# Altium schematic sheet ADC_Interface.SchDoc
size A4; SheetNumber: 6; SheetTotal: 16
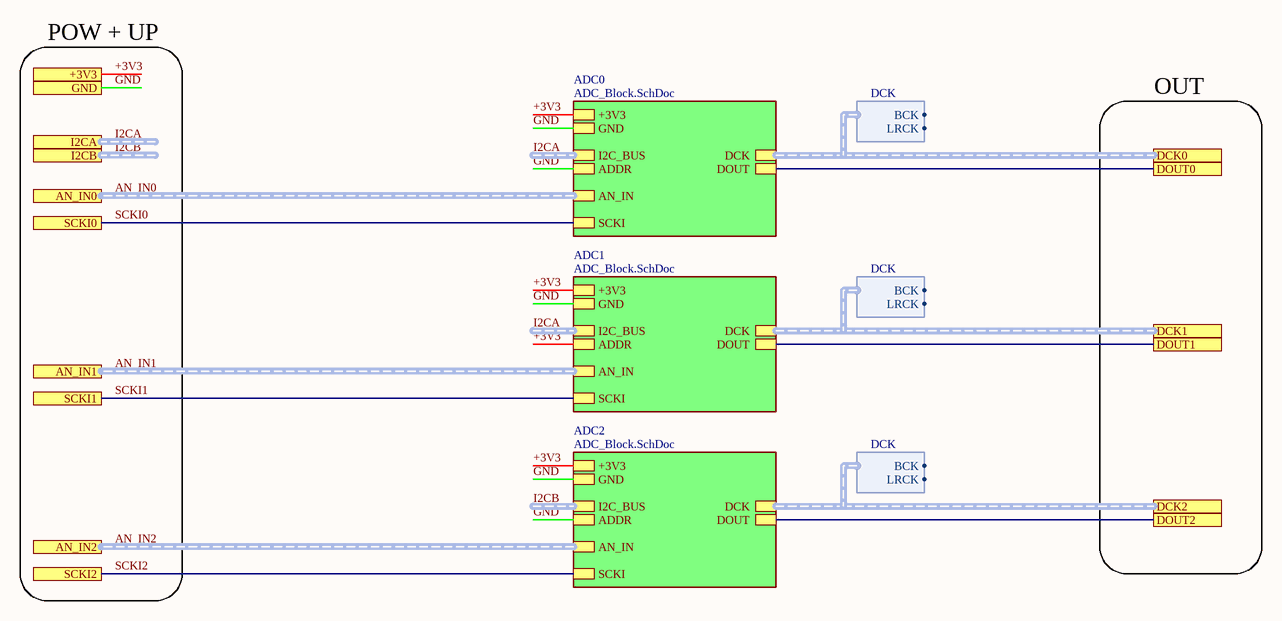
[diagram p0: ADC_Interface.SchDoc]

## Sub-sheets
ADC0 = ADC_Block.SchDoc: +3V3, GND, I2C_BUS (harness I2C), AN_IN (harness AN), SCKI, DCK (harness DCK), DOUT, ADDR
ADC1 = ADC_Block.SchDoc: +3V3, GND, I2C_BUS (harness I2C), AN_IN (harness AN), SCKI, DCK (harness DCK), DOUT, ADDR
ADC2 = ADC_Block.SchDoc: +3V3, GND, I2C_BUS (harness I2C), AN_IN (harness AN), SCKI, DCK (harness DCK), DOUT, ADDR

## Ports
+3V3 (see AudioDSP-v3.1.1_top[2B], ADC_Block[1A], CLK_Block[1B], CTRL_Connectors[1A], DSP_Block[1A], DSP_Interface[1A], MCU_Block[1A], POW_Block[4B], THM_Block[1B]), AN_IN0 (harness AN, see AudioDSP-v3.1.1_top[2B], IN_Connectors[3C]), AN_IN1 (harness AN, see AudioDSP-v3.1.1_top[2B], IN_Connectors[3C]), AN_IN2 (harness AN, see AudioDSP-v3.1.1_top[2B], IN_Connectors[3C]), DCK0 (harness DCK, see AudioDSP-v3.1.1_top[3B]), DCK1 (harness DCK, see AudioDSP-v3.1.1_top[3B]), DCK2 (harness DCK, see AudioDSP-v3.1.1_top[3C]), DOUT0 (see AudioDSP-v3.1.1_top[3B]), DOUT1 (see AudioDSP-v3.1.1_top[3B]), DOUT2 (see AudioDSP-v3.1.1_top[3C]), GND (see AudioDSP-v3.1.1_top[2B], ADC_Block[1B], CLK_Block[1B], CTRL_Connectors[1A], DAC_Block[1B], DAC_Interface[1B], DSP_Block[1A], DSP_Interface[1A], IN_Connectors[3A], LPF_Block[1B], LPF_Interface[1B], MCU_Block[1B], OUT_Connectors[3B], POW_Block[1A], THM_Block[1B]), I2CA (harness I2C, see AudioDSP-v3.1.1_top[2B]), I2CB (harness I2C, see AudioDSP-v3.1.1_top[2B]), SCKI0 (see AudioDSP-v3.1.1_top[3C], DAC_Interface[1B]), SCKI1 (see AudioDSP-v3.1.1_top[3C], DAC_Interface[1B]), SCKI2 (see AudioDSP-v3.1.1_top[3C], DAC_Interface[1C])

## Harnesses
DCK: BCK, LRCK

## Nets
+3V3: port +3V3, sheet ADC0/+3V3, sheet ADC1/+3V3, sheet ADC1/ADDR, sheet ADC2/+3V3
DOUT0: port DOUT0, sheet ADC0/DOUT
DOUT1: port DOUT1, sheet ADC1/DOUT
DOUT2: port DOUT2, sheet ADC2/DOUT
GND: port GND, sheet ADC0/GND, sheet ADC0/ADDR, sheet ADC1/GND, sheet ADC2/GND, sheet ADC2/ADDR
SCKI0: port SCKI0, sheet ADC0/SCKI
SCKI1: port SCKI1, sheet ADC1/SCKI
SCKI2: port SCKI2, sheet ADC2/SCKI

## Buses and harness runs
harness AN_IN0 = port AN_IN0 = sheet ADC0/AN_IN
harness AN_IN1 = port AN_IN1 = sheet ADC1/AN_IN
harness AN_IN2 = port AN_IN2 = sheet ADC2/AN_IN
harness I2CA = port I2CA
harness I2CA = sheet ADC0/I2C_BUS
harness I2CA = sheet ADC1/I2C_BUS
harness I2CB = port I2CB
harness I2CB = sheet ADC2/I2C_BUS
harness port DCK0 = sheet ADC0/DCK
harness port DCK1 = sheet ADC1/DCK
harness port DCK2 = sheet ADC2/DCK

## Notes on the sheet
- POW + UP
- OUT